# EAGLE design usb_power_ctrl (EAGLE 5.10)
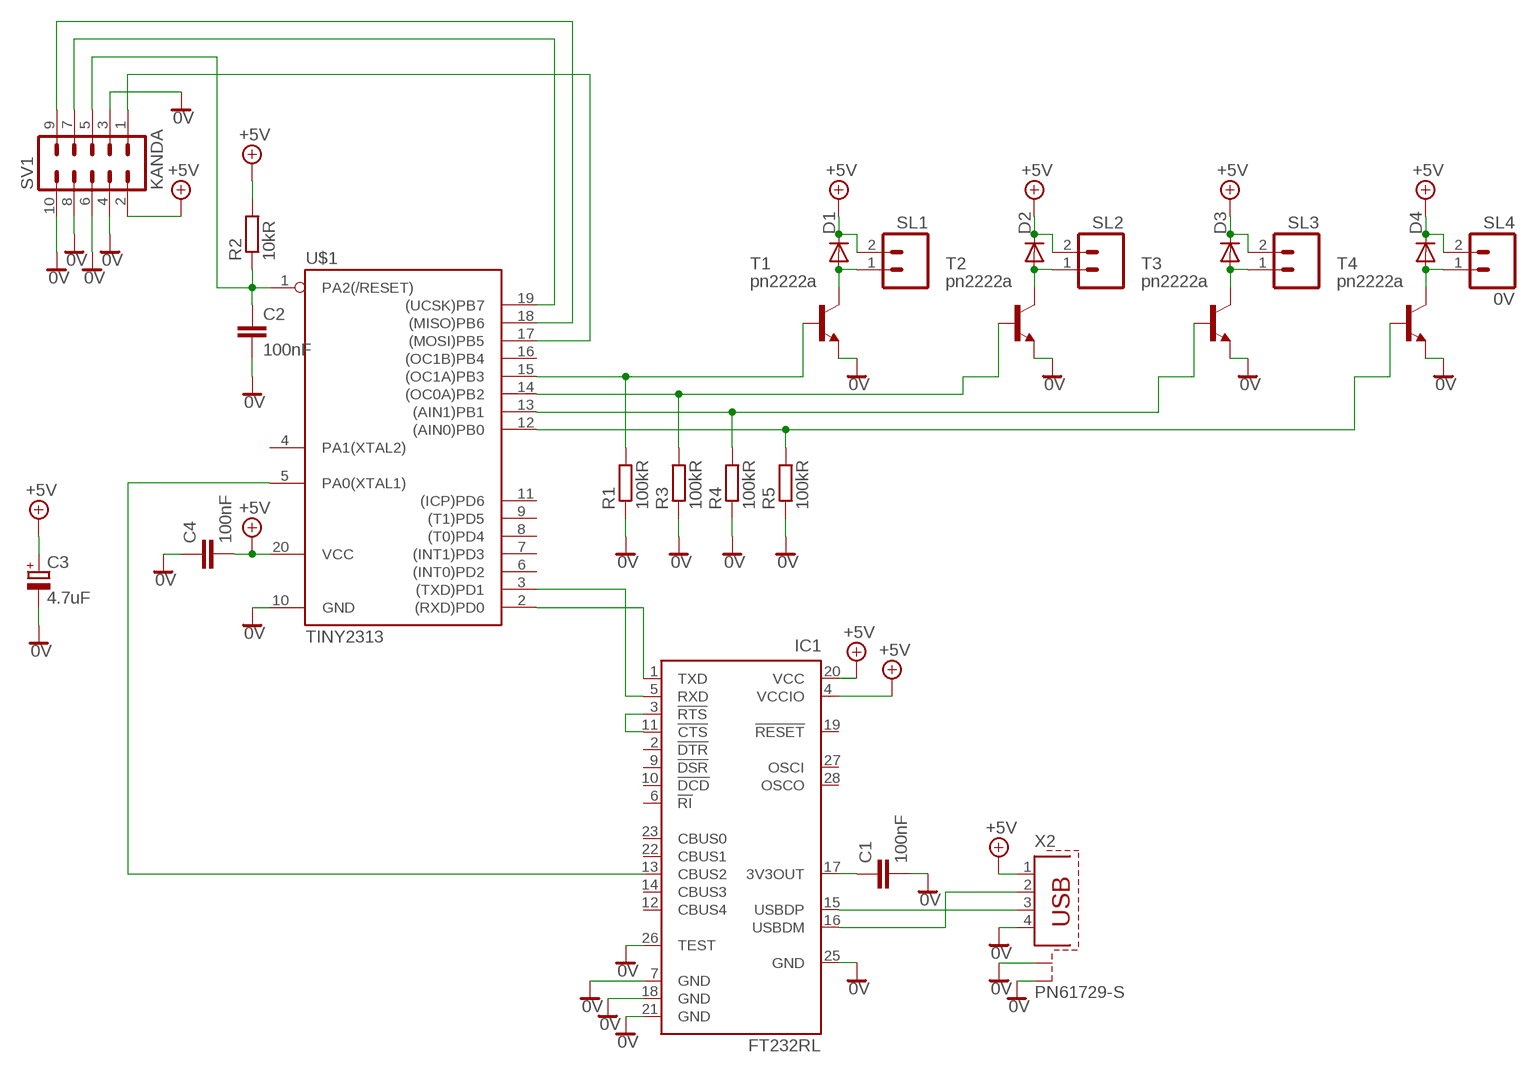
[diagram p0: schematic, sheet 1]

## Parts
C1  100nF  C-EUC3216  [C3216]
C2  100nF  C-EUC3216  [C3216]
C3  4.7uF  CPOL-EU153CLV-0405  [153CLV-0405]
C4  100nF  C-EUC3216  [C3216]
D1  DIODE-SOD106A-R  [SOD106A-R]
D2  DIODE-SOD106A-R  [SOD106A-R]
D3  DIODE-SOD106A-R  [SOD106A-R]
D4  DIODE-SOD106A-R  [SOD106A-R]
IC1  FT232RL  [SSOP28]
R1  100kR  R-EU_MELF0204W  [MINI_MELF-0204W]
R2  10kR  R-EU_MELF0204W  [MINI_MELF-0204W]
R3  100kR  R-EU_MELF0204W  [MINI_MELF-0204W]
R4  100kR  R-EU_MELF0204W  [MINI_MELF-0204W]
R5  100kR  R-EU_MELF0204W  [MINI_MELF-0204W]
SL1  M02  [02P]
SL2  M02  [02P]
SL3  M02  [02P]
SL4  0V  M02  [02P]
SV1  KANDA  ML10  [ML10]
T1  pn2222a  MPS2222A-NPN-TO92-CBE  [TO92-CBE]
T2  pn2222a  MPS2222A-NPN-TO92-CBE  [TO92-CBE]
T3  pn2222a  MPS2222A-NPN-TO92-CBE  [TO92-CBE]
T4  pn2222a  MPS2222A-NPN-TO92-CBE  [TO92-CBE]
U$1  TINY2313  TINY2313-*S*  [SO20L$]
X2  PN61729-S  [PN61729-S]

## Nets
0V: C1.2 C2.2 C3.- C4.1 IC1.7(GND) IC1.18(GND) IC1.21(GND) IC1.25(GND) IC1.26(TEST) R1.1 R3.1 R4.1 R5.1 SV1.3 SV1.4 SV1.6 SV1.8 SV1.10 T1.E T2.E T3.E T4.E U$1.10(GND) X2.4 X2.S1 X2.S2
+5V: C3.+ C4.2 D1.C D2.C D3.C D4.C IC1.4(VCCIO) IC1.20(VCC) R2.2 SL1.2 SL2.2 SL3.2 SL4.2 SV1.2 U$1.20(VCC) X2.1
N$1: IC1.3(!RTS) IC1.11(!CTS)
N$2: IC1.1(TXD) U$1.2((RXD)PD0)
N$3: IC1.5(RXD) U$1.3((TXD)PD1)
N$4: IC1.15(USBDP) X2.3
N$5: IC1.16(USBDM) X2.2
N$6: C1.1 IC1.17(3V3OUT)
N$7: IC1.13(CBUS2) U$1.5(PA0(XTAL1))
N$8: D1.A SL1.1 T1.C
N$9: R1.2 T1.B U$1.15((OC1A)PB3)
N$10: D2.A SL2.1 T2.C
N$11: R3.2 T2.B U$1.14((OC0A)PB2)
N$12: D3.A SL3.1 T3.C
N$13: R4.2 T3.B U$1.13((AIN1)PB1)
N$14: D4.A SL4.1 T4.C
N$15: R5.2 T4.B U$1.12((AIN0)PB0)
N$16: C2.1 R2.1 SV1.5 U$1.1(PA2(/RESET))
N$17: SV1.1 U$1.17((MOSI)PB5)
N$19: SV1.7 U$1.19((UCSK)PB7)
N$20: SV1.9 U$1.18((MISO)PB6)
Unconnected: IC1.2(!DTR) IC1.6(!RI) IC1.9(!DSR) IC1.10(!DCD) IC1.12(CBUS4) IC1.14(CBUS3) IC1.19(!RESET) IC1.22(CBUS1) IC1.23(CBUS0) IC1.27(OSCI) IC1.28(OSCO) U$1.4(PA1(XTAL2)) U$1.6((INT0)PD2) U$1.7((INT1)PD3) U$1.8((T0)PD4) U$1.9((T1)PD5) U$1.11((ICP)PD6) U$1.16((OC1B)PB4)

## Library data of the parts
C1 C2 C4 = rcl:C-EU: CAPACITOR, European symbol
C3 = rcl:CPOL-EU: POLARIZED CAPACITOR, European symbol
D1-D4 = diode:DIODE-: DIODE
IC1 = ftdichip:FT232R: Source: http://www.ftdichip.com/Documents/DataSheets/DS_FT232R_v104.pdf
R1-R5 = rcl:R-EU_: RESISTOR, European symbol
SL1-SL4 = con-amp-quick:M02: AMP QUICK CONNECTOR
SV1 = con-harting-ml:ML10: HARTING
T1-T4 = transistor:*-NPN-: NPN Transistror BF959 corrected 2008.03.06
U$1 = avr-7:TINY2313*: Atmel Tiny2313 2K Flash, 128 bytes EEPROM, 128 bytes RAM
X2 = con-berg:PN61729-S: BERG USB connector

## Board
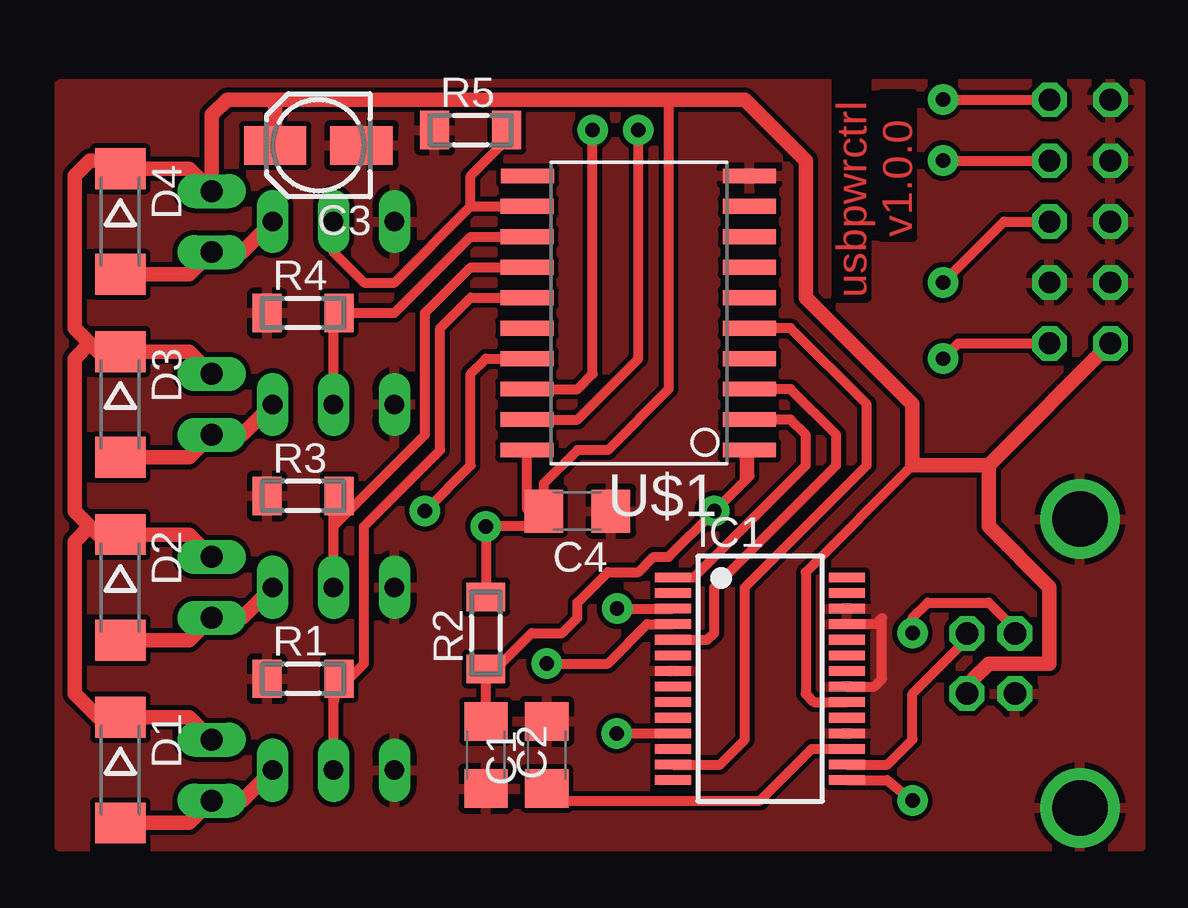
[diagram p1: board, top side]
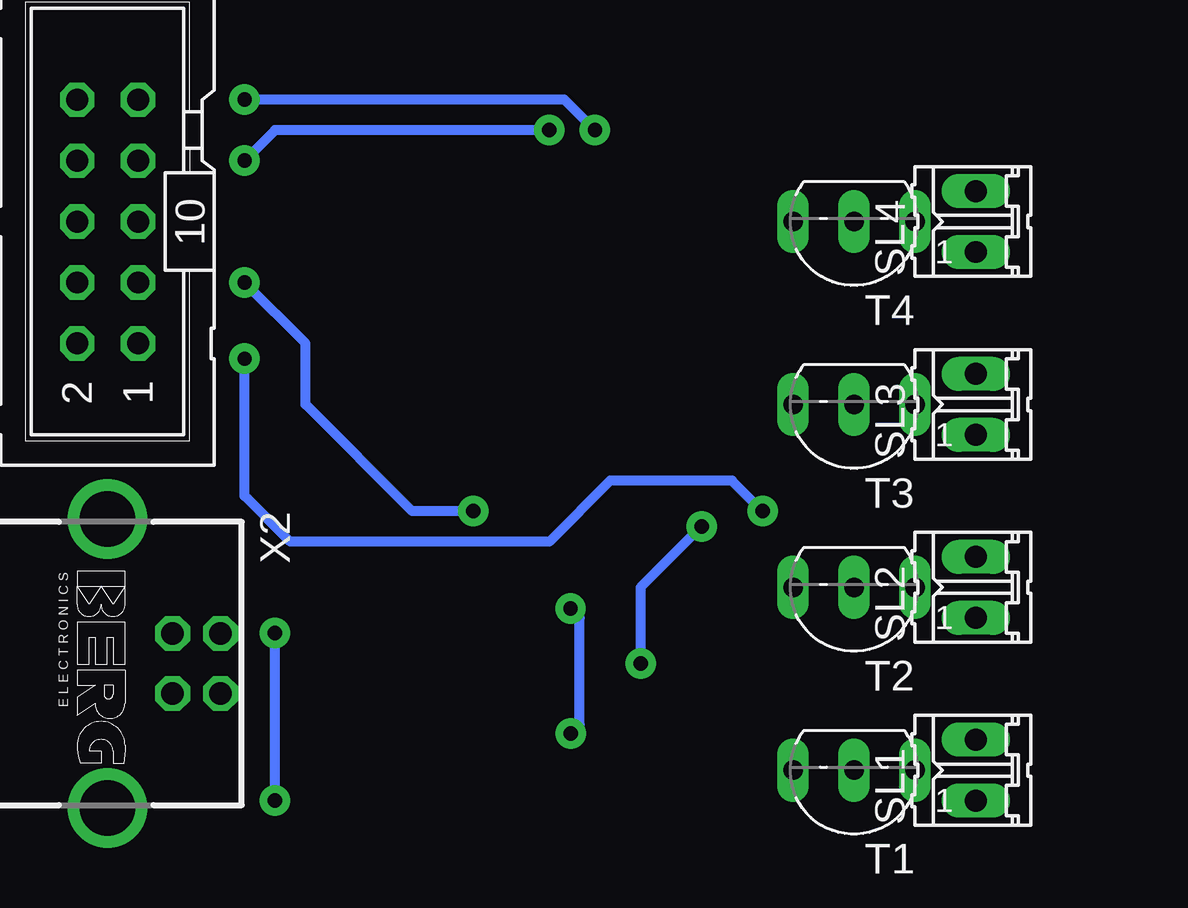
[diagram p2: board, bottom side, seen from below]

No outline drawn. Coordinates in mm, seen from the top.
Copper layers (1*16): Top 0.035mm / dielectric 1.5mm / Bottom 0.035mm
Design rules "default": minimum track width 10mil, minimum drill 24mil, track to track 8mil, track to pad 8mil, pad to pad 8mil, via to via 8mil, smd to smd 8mil, copper to edge 40mil, drill to drill 8mil, minimum pad ring 10mil, minimum via ring 8mil, stop-mask expansion 4mil, vias tented up to drill 0mil, thermal gap 10mil

### Footprints (pad centres in the part's own frame; a part is rotated, then mirrored left to right if it is on the bottom)
C3216 = smd 1.6 x 1.8: 1 -1.4,0; 2 1.4,0
153CLV-0405 = smd 2.6 x 1.6: + 1.8,0; - -1.8,0
SOD106A-R = smd 1.7 x 2.1: A 2.2,0; C -2.2,0
SSOP28 = smd 0.4 x 1.5: 1 -4.225,-3.625; 2 -3.575,-3.625; 3 -2.925,-3.625; 4 -2.275,-3.625; 5 -1.625,-3.625; 6 -0.975,-3.625; 7 -0.325,-3.625; 8 0.325,-3.625; 9 0.975,-3.625; 10 1.625,-3.625; 11 2.275,-3.625; 12 2.925,-3.625; 13 3.575,-3.625; 14 4.225,-3.625; 15 4.225,3.625; 16 3.575,3.625; 17 2.925,3.625; 18 2.275,3.625; 19 1.625,3.625; 20 0.975,3.625; 21 0.325,3.625; 22 -0.325,3.625; 23 -0.975,3.625; 24 -1.625,3.625; 25 -2.275,3.625; 26 -2.925,3.625; 27 -3.575,3.625; 28 -4.225,3.625
MINI_MELF-0204W = smd 1.2 x 1.6: 1 -1.5,0; 2 1.5,0
02P = drill 0.914 long: 1 -1.27,0; 2 1.27,0
ML10 = drill 0.914 octagon: 1 -5.08,-1.27; 2 -5.08,1.27; 3 -2.54,-1.27; 4 -2.54,1.27; 5 0,-1.27; 6 0,1.27; 7 2.54,-1.27; 8 2.54,1.27; 9 5.08,-1.27; 10 5.08,1.27
TO92-CBE = drill 0.813 long: B 0,0; C -2.54,0; E 2.54,0
SO20L$ = smd 0.61 x 2.21: 1 -5.715,-4.636; 2 -4.445,-4.636; 3 -3.175,-4.636; 4 -1.905,-4.636; 5 -0.635,-4.636; 6 0.635,-4.636; 7 1.905,-4.636; 8 3.175,-4.636; 9 4.445,-4.636; 10 5.715,-4.636; 11 5.715,4.61; 12 4.445,4.636; 13 3.175,4.636; 14 1.905,4.636; 15 0.635,4.636; 16 -0.635,4.636; 17 -1.905,4.636; 18 -3.175,4.636; 19 -4.445,4.636; 20 -5.715,4.636
PN61729-S = drill 0.95 octagon: 1 1.25,4.71; 2 -1.25,4.71; 3 -1.25,2.71; 4 1.25,2.71 | drill 2.3 pad 2.9 round: S1 -6.02,0; S2 6.02,0

### Placement (x,y rotation side)
C1  38.1,33.66 90 top
C2  35.56,33.66 270 top
C3  28.57,59.05 180 top
C4  39.37,43.81 180 top
D1  20.32,33.02 270 top
D2  20.32,40.64 270 top
D3  20.32,48.26 270 top
D4  20.32,55.88 270 top
IC1  46.99,36.83 270 top
R1  27.94,36.83 0 top
R2  35.56,38.73 90 top
R3  27.94,44.45 0 top
R4  27.94,52.07 0 top
R5  34.92,59.69 0 top
SL1  24.13,33.02 90 bottom
SL2  24.13,40.64 90 bottom
SL3  24.13,48.26 90 bottom
SL4  24.13,55.88 90 bottom
SV1  60.33,55.88 90 bottom
T1  29.21,33.02 180 bottom
T2  29.21,40.64 180 bottom
T3  29.21,48.26 180 bottom
T4  29.21,55.88 180 bottom
U$1  41.91,52.07 90 top
X2  60.33,37.47 270 bottom

### Tracks (layer width: path | path; a pad name or v marks a point on that pad's centre or on a via)
0V
  Top 0.406: IC1.25 51.8,39.1 52.07,39.37 52.07,36.83 51.74,36.51 IC1.21
  pour Top: 17.78,61.59 17.78,29.84 62.87,29.84 62.87,61.59
+5V  (via drill 0.6 pad 1.27)
  Top 0.406: U$1.20 37.27,43.88 C4.2 | IC1.20 49.23,35.85 48.9,36.2 48.9,41.27 53.34,45.72 | IC1.4 42.28,39.1 40.64,37.47 v38.1,37.47 | C4.2 37.97,44.95 39.37,46.35 40.64,46.35 43.18,48.9 43.18,60.96 | 19.39,35.22 D1.C | 19.05,43.18 19.98,43.18 D2.C 19.39,42.84 | 19.05,50.8 19.98,50.8 D3.C 19.39,50.46 | 19.98,58.42 D4.C | R2.2 v35.56,43.18 37.34,43.18 C4.2 | 26.67,60.96 26.77,60.85 | 55.88,36.83 55.88,36.48
  Top 0.61: D4.C 23.2,58.08 SL4.2 24.13,60.33 24.77,60.96 26.67,60.96 43.18,60.96 46.35,60.96 48.9,58.42 48.9,52.7 53.34,48.26 53.34,45.72 56.52,45.72 | D3.C 23.2,50.46 SL3.2 | D2.C 23.2,42.84 SL2.2 | D1.C 23.2,35.22 SL1.2 | 19.39,35.22 18.41,36.2 18.41,42.55 19.05,43.18 | 19.05,43.18 19.39,42.84 | 19.05,43.18 18.41,43.81 18.41,50.16 19.05,50.8 | 19.05,50.8 19.39,50.46 | 19.05,50.8 18.41,51.44 18.41,57.78 19.05,58.42 19.98,58.42 | 56.52,45.72 SV1.2 | 26.77,60.85 C3.+ | 56.52,45.72 56.52,43.18 59.05,40.64 59.05,37.47 56.52,37.47 55.88,36.83 | 55.88,36.48 X2.1
  Bottom 0.406: v38.1,37.47 38.1,40.64 v35.56,43.18
N$1  (via drill 0.6 pad 1.27)
  Top 0.406: v41.02,39.76 IC1.3 | v41.01,34.55 IC1.11
  Bottom 0.406: v41.02,39.76 40.64,39.37 40.64,34.92 v41.01,34.55
N$2
  Top 0.406: U$1.2 48.26,47.62 48.9,46.99 48.9,45.72 44.23,41.05 IC1.1
N$3
  Top 0.406: U$1.3 48.26,48.9 50.16,46.99 50.16,45.72 45.09,40.64 45.09,38.73 44.8,38.45 IC1.5
N$4  (via drill 0.6 pad 1.27)
  Top 0.406: IC1.15 52.29,32.6 v53.34,31.75 | v53.34,38.73 53.34,39.37 53.98,40.01 56.52,40.01 57.62,38.91 X2.3
  Bottom 0.406: v53.34,31.75 v53.34,38.73
N$5
  Top 0.406: IC1.16 52.3,33.26 53.34,34.29 53.34,36.2 55.62,38.47 X2.2
N$6
  Top 0.406: IC1.17 49.15,33.91 46.99,31.75 38.73,31.75 38.1,32.38 38.23,32.38 C1.1
N$7
  Top 0.406: U$1.5 48.26,51.44 51.44,48.26 51.44,45.72 46.35,40.64 46.35,34.29 45.32,33.26 IC1.13
N$8
  Top 0.61: D1.A 23.2,30.82 SL1.1 25.4,31.75 T1.C
N$9
  Top 0.406: U$1.15 34.92,52.7 33.66,51.44 33.66,46.35 30.48,43.18 30.48,37.47 29.21,36.2 T1.B 29.21,35.79 R1.2
N$10
  Top 0.61: D2.A 23.2,38.44 SL2.1 25.4,39.37 T2.C
N$11
  Top 0.406: U$1.14 34.92,53.98 33.02,52.07 33.02,46.99 29.21,43.18 T2.B 29.21,44.85 R3.2
N$12
  Top 0.61: D3.A 23.2,46.06 SL3.1 25.4,46.99 T3.C
N$13
  Top 0.406: U$1.13 34.92,55.24 31.75,52.07 29.21,52.07 | T3.B 29.21,52.07 | 29.21,52.07 29.21,52.48 R4.2
N$14
  Top 0.61: D4.A 23.2,53.68 SL4.1 25.4,54.61 T4.C
N$15
  Top 0.406: 34.92,56.52 U$1.12 | 34.92,56.52 31.75,53.34 30.48,53.34 29.21,54.61 T4.B | R5.2 36.42,59.28 34.92,57.78 34.92,56.52
N$16  (via drill 0.6 pad 1.27)
  Top 0.406: C2.1 R2.1 35.97,37.23 37.47,38.73 38.73,38.73 39.37,39.37 39.37,40.01 40.64,41.27 41.91,41.27 42.55,41.91 43.18,41.91 v45.09,43.81 46.35,45.09 | 46.35,45.09 46.35,46.16 U$1.1 46.55,45.28 46.35,45.09 | SV1.5 57.15,55.88 v54.61,53.34
  Bottom 0.406: v45.09,43.81 47.62,43.81 52.07,48.26 52.07,50.8 v54.61,53.34
N$17  (via drill 0.6 pad 1.27)
  Top 0.406: U$1.17 35.56,50.16 34.92,49.53 34.92,45.72 v33.02,43.81 | v54.61,50.16 55.24,50.8 SV1.1
  Bottom 0.406: v33.02,43.81 34.29,45.09 39.37,45.09 41.91,42.55 52.7,42.55 54.61,44.45 v54.61,50.16
N$19  (via drill 0.6 pad 1.27)
  Top 0.406: U$1.19 39.37,47.62 41.91,50.16 v41.91,59.69 | v54.61,58.42 SV1.7
  Bottom 0.406: v41.91,59.69 53.34,59.69 v54.61,58.42
N$20  (via drill 0.6 pad 1.27)
  Top 0.406: U$1.18 39.37,48.9 40.01,49.53 v40.01,59.69 | v54.61,60.96 SV1.9
  Bottom 0.406: v40.01,59.69 41.27,60.96 v54.61,60.96

### Text on the board
Top: v1.0.0 | usbpwrctrl